# EAGLE design habitat (EAGLE 9.4.2)

## Sheet 1 of 2
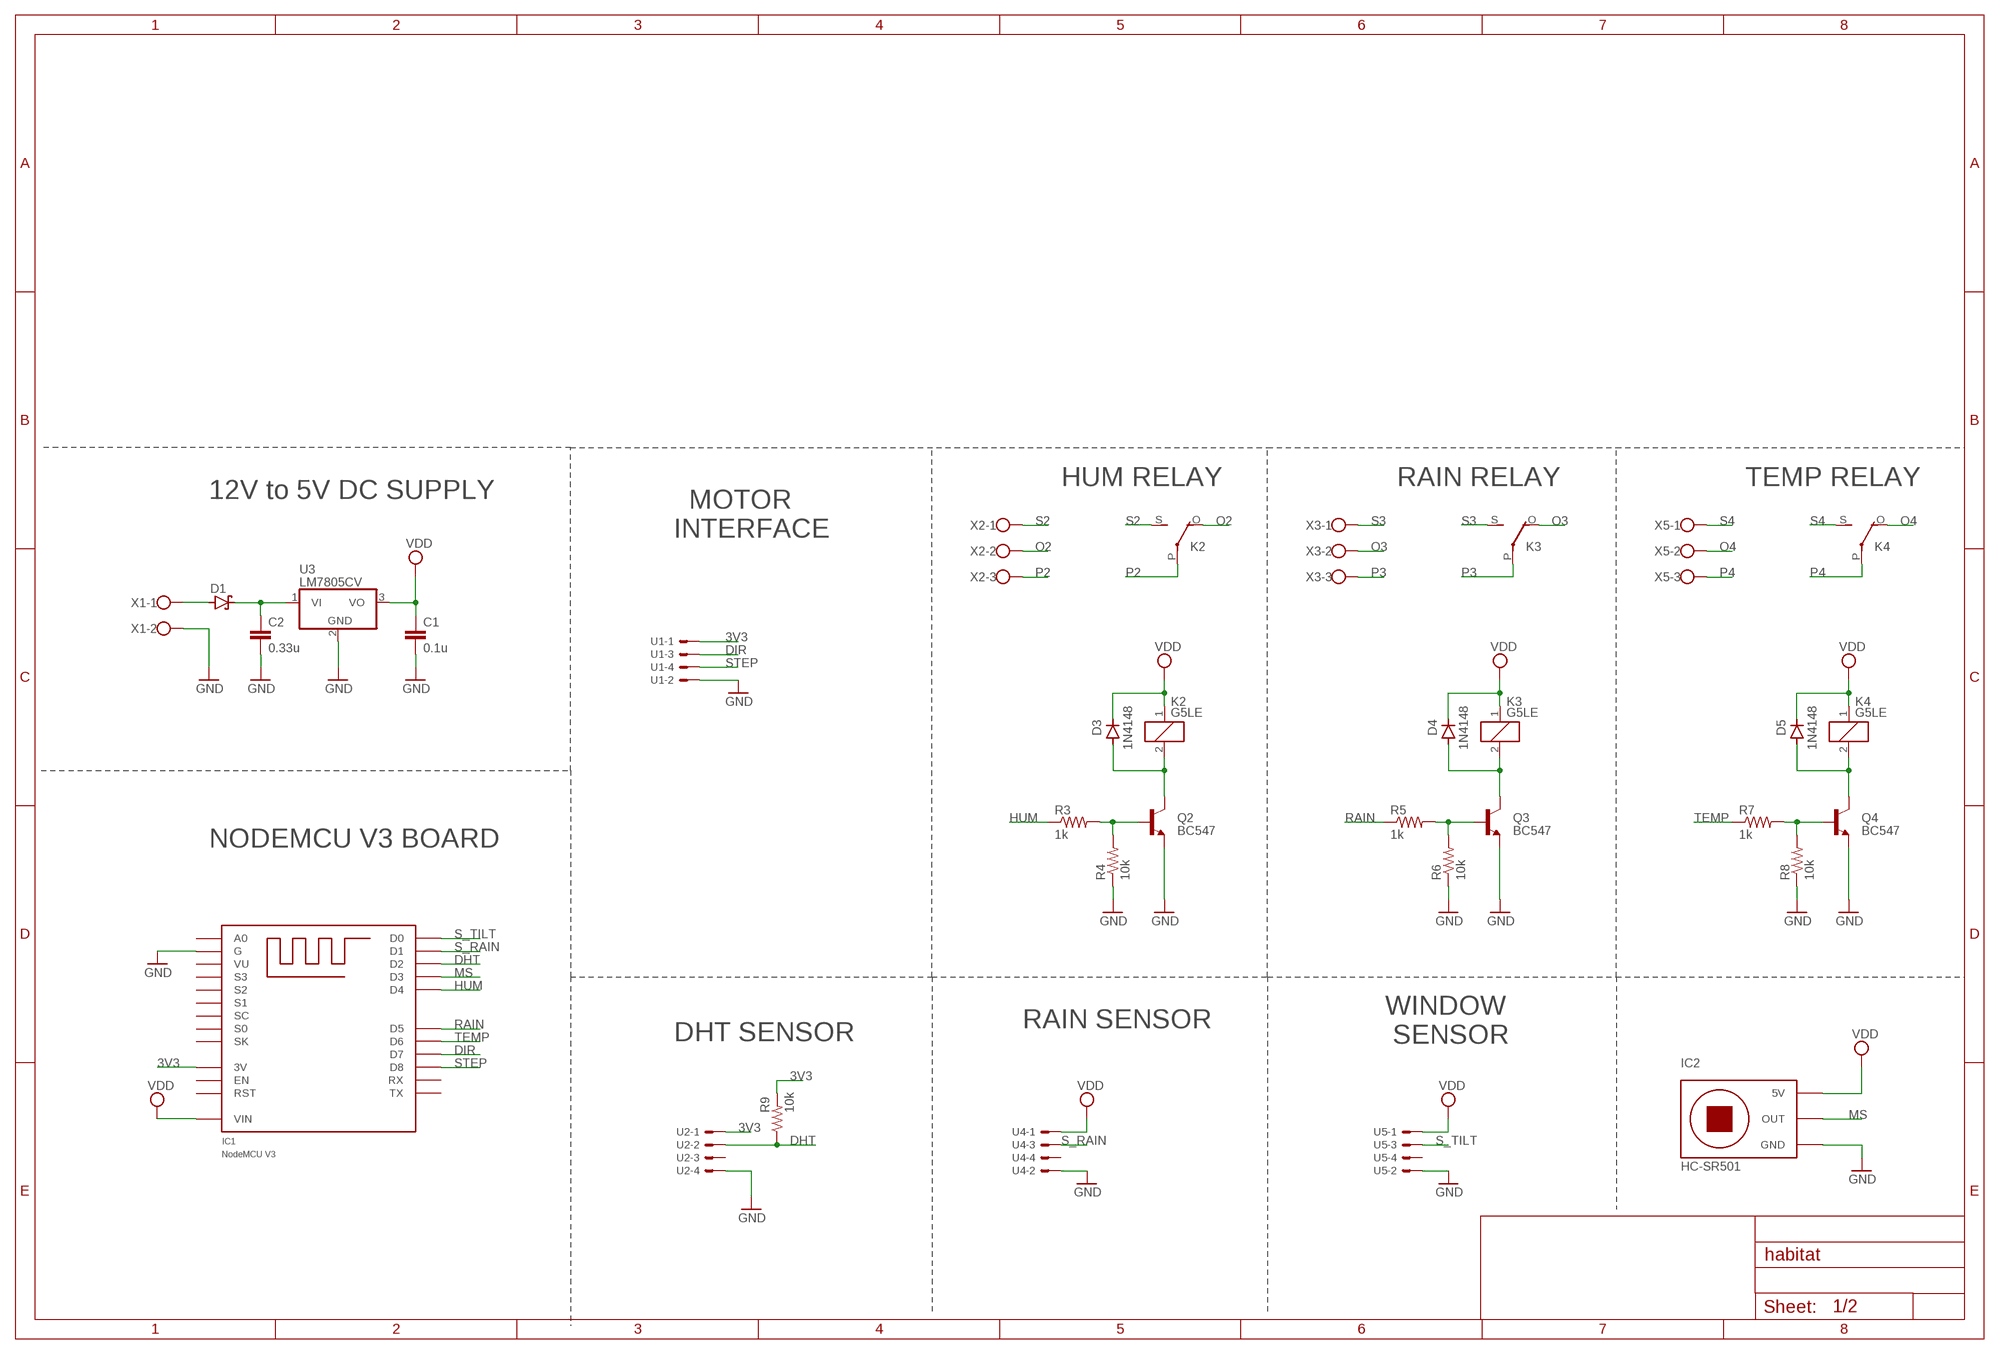
[diagram p0: schematic, sheet 1]

### Parts
C1  0.1u  C-EU025-030X050  [C025-030X050]
C2  0.33u  C-EU025-030X050  [C025-030X050]
D1  1N5817-T  [DO41-7.6]
D3  1N4148  1N4148DO35-7  [DO35-7]
D4  1N4148  1N4148DO35-7  [DO35-7]
D5  1N4148  1N4148DO35-7  [DO35-7]
IC1  NODEMCU_V3  [NODEMCU_V3]
IC2  HC-SR501  [HC-SR501]
K2  G5LE  [G5LE]
K3  G5LE  [G5LE]
K4  G5LE  [G5LE]
Q2  BC547  [TO92]
Q3  BC547  [TO92]
Q4  BC547  [TO92]
R3  1k  R-US_0309/10  [0309/10]
R4  10k  R-US_0309/10  [0309/10]
R5  1k  R-US_0309/10  [0309/10]
R6  10k  R-US_0309/10  [0309/10]
R7  1k  R-US_0309/10  [0309/10]
R8  10k  R-US_0309/10  [0309/10]
R9  10k  R-US_0309/10  [0309/10]
U1  KK-156-4  [KK-156-4]
U2  KK-156-4  [KK-156-4]
U3  LM7805CV  7805T  [TO220H]
U4  KK-156-4  [KK-156-4]
U5  KK-156-4  [KK-156-4]
X1  W237-102  [W237-102]
X2  W237-103  [W237-103]
X3  W237-103  [W237-103]
X5  W237-103  [W237-103]

### Nets
3V3: IC1.P$11(3V) IC1.P$16(3V) IC1.P$25(3V) R9.2 U1.1 U2.1
DHT: IC1.P$28(D2) R9.1 U2.2
DIR: IC1.P$21(D7) U1.3
GND: C1.2 C2.2 IC1.P$2(G) IC1.P$10(G) IC1.P$14(G) IC1.P$17(G) IC1.P$24(G) IC2.GND Q2.1(E) Q3.1(E) Q4.1(E) R4.1 R6.1 R8.1 U1.2 U2.4 U3.2(GND) U4.2 U5.2 X1.2
HUM: IC1.P$26(D4) R3.1
MS: IC1.P$27(D3) IC2.OUT
N$1: C2.1 D1.C U3.1(VI)
N$2: D1.A X1.1
N$3: D3.A K2.2 Q2.3(C)
N$4: Q2.2(B) R3.2 R4.2
N$5: D4.A K3.2 Q3.3(C)
N$6: Q3.2(B) R5.2 R6.2
N$7: D5.A K4.2 Q4.3(C)
N$8: Q4.2(B) R7.2 R8.2
O2: K2.O(2:O) X2.2
O3: K3.O(2:O) X3.2
O4: K4.O(2:O) X5.2
P2: K2.P(2:P) X2.3
P3: K3.P(2:P) X3.3
P4: K4.P(2:P) X5.3
RAIN: IC1.P$23(D5) R5.1
S2: K2.S(2:S) X2.1
S3: K3.S(2:S) X3.1
S4: K4.S(2:S) X5.1
S_RAIN: IC1.P$29(D1) U4.3
S_TILT: IC1.P$30(D0) U5.3
STEP: IC1.P$20(D8) U1.4
TEMP: IC1.P$22(D6) R7.1
VDD: C1.1 D3.C D4.C D5.C IC1.P$15(VIN) IC2.VDD(5V) K2.1 K3.1 K4.1 U3.3(VO) U4.1 U5.1
Unconnected: IC1.P$1(A0) IC1.P$3(VU) IC1.P$4(S3) IC1.P$5(S2) IC1.P$6(S1) IC1.P$7(SC) IC1.P$8(S0) IC1.P$9(SK) IC1.P$12(EN) IC1.P$13(RST) IC1.P$18(TX) IC1.P$19(RX) U2.3 U4.4 U5.4

### Notes on the sheet
- HUM RELAY | RAIN RELAY | TEMP RELAY
- 12V to 5V DC SUPPLY
- MOTOR
  INTERFACE
- NODEMCU V3 BOARD
- RAIN SENSOR
- DHT SENSOR
- WINDOW
   SENSOR

## Sheet 2 of 2

## Library data of the parts
C1 C2 = rcl:C-EU: CAPACITOR, European symbol; SPICEPREFIX: C
D1 = diode:1N581*: 1.0A SCHOTTKY BARRIER RECTIFIER Source: http://www.diodes.com/datasheets/ds23001.pdf
D3-D5 = diode:1N4148: DIODE high speed (Philips)
IC1 = emndbed_std:NODEMCU_V3
IC2 = licenta:HC-SR501
K2-K4 = relay:G5LE: RELAY 1 x switch, 10 A/120 V AC, 8 A/30 V DC, Omron; OC_FARNELL: unknown; OC_NEWARK: unknown
Q2-Q4 = transistor:BC547: NPN TRANSISTOR
R3-R9 = rcl:R-US_: RESISTOR, American symbol; SPICEPREFIX: R
U1 U2 U4 U5 = con-molex:KK-156-4: KK 156 HEADER Source: http://www.molex.com/pdm_docs/sd/026604100_sd.pdf; MF: MOLEX; OC_FARNELL: unknown; OC_NEWARK: unknown
U3 = linear:78*: Positive VOLTAGE REGULATOR Source: http://cache.national.com/ds/LM/LM78L05.pdf http://www.fairchildsemi.com/ds/LM/LM7805.pdf
X1 = con-wago-500:W237-102: WAGO SCREW CLAMP; MPN: 237-102; OC_FARNELL: unknown; OC_NEWARK: 70K9898
X2 X3 X5 = con-wago-500:W237-103: WAGO SCREW CLAMP; MPN: 237-103; OC_FARNELL: unknown; OC_NEWARK: 18M7116

## Board
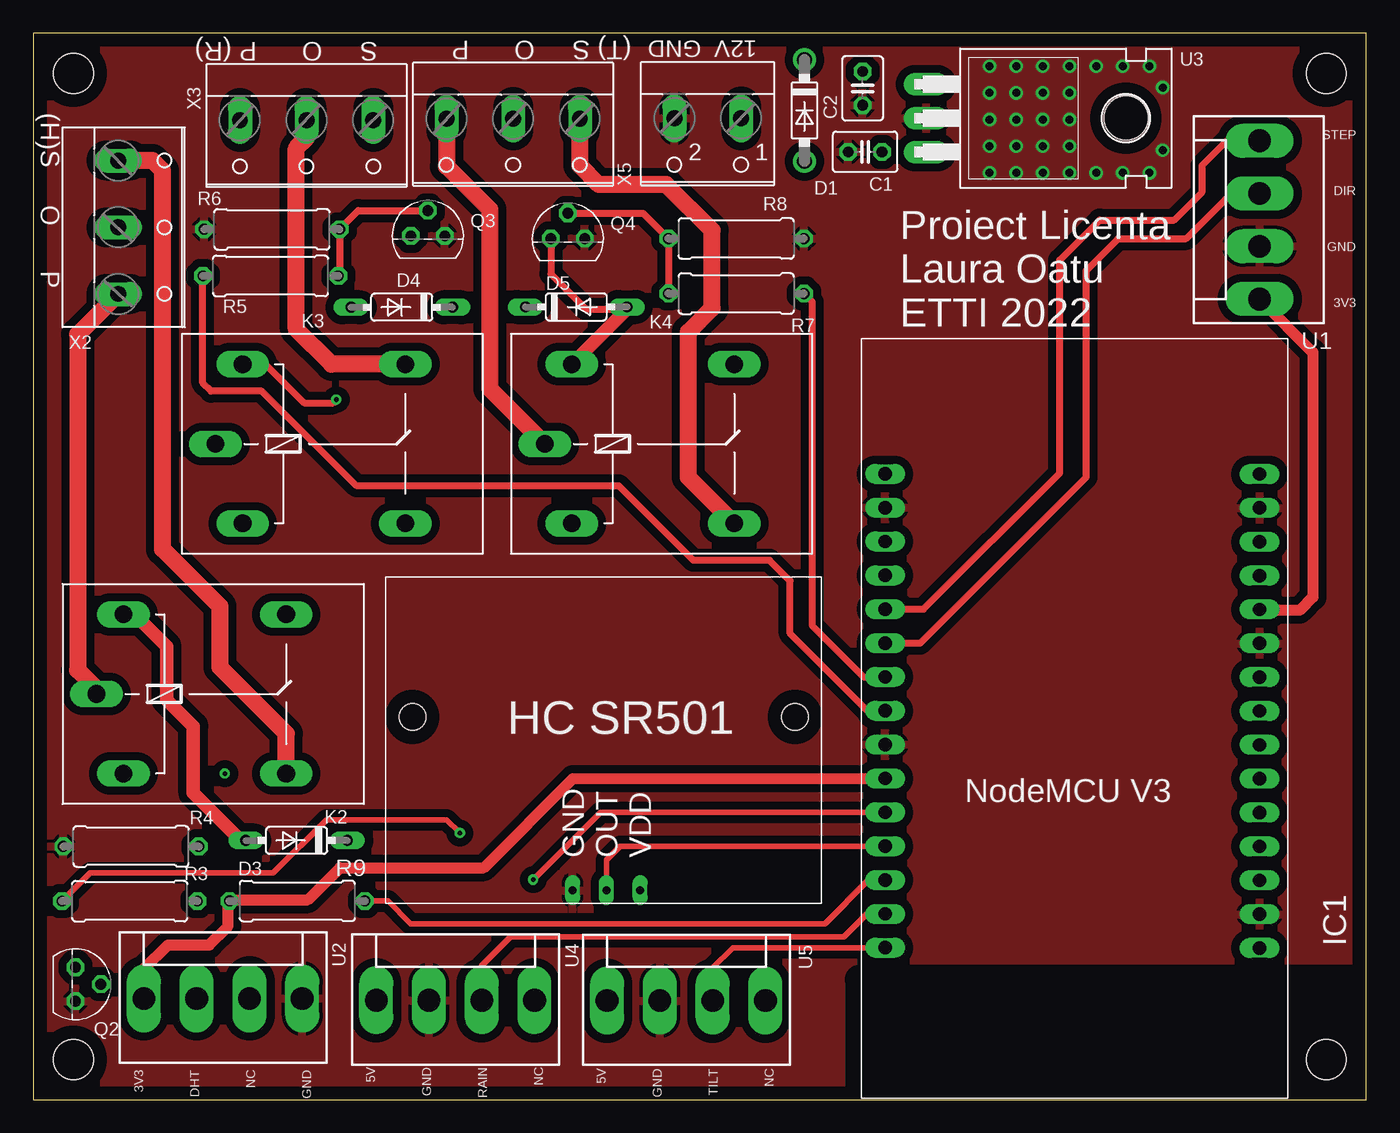
[diagram p1: board, top side]
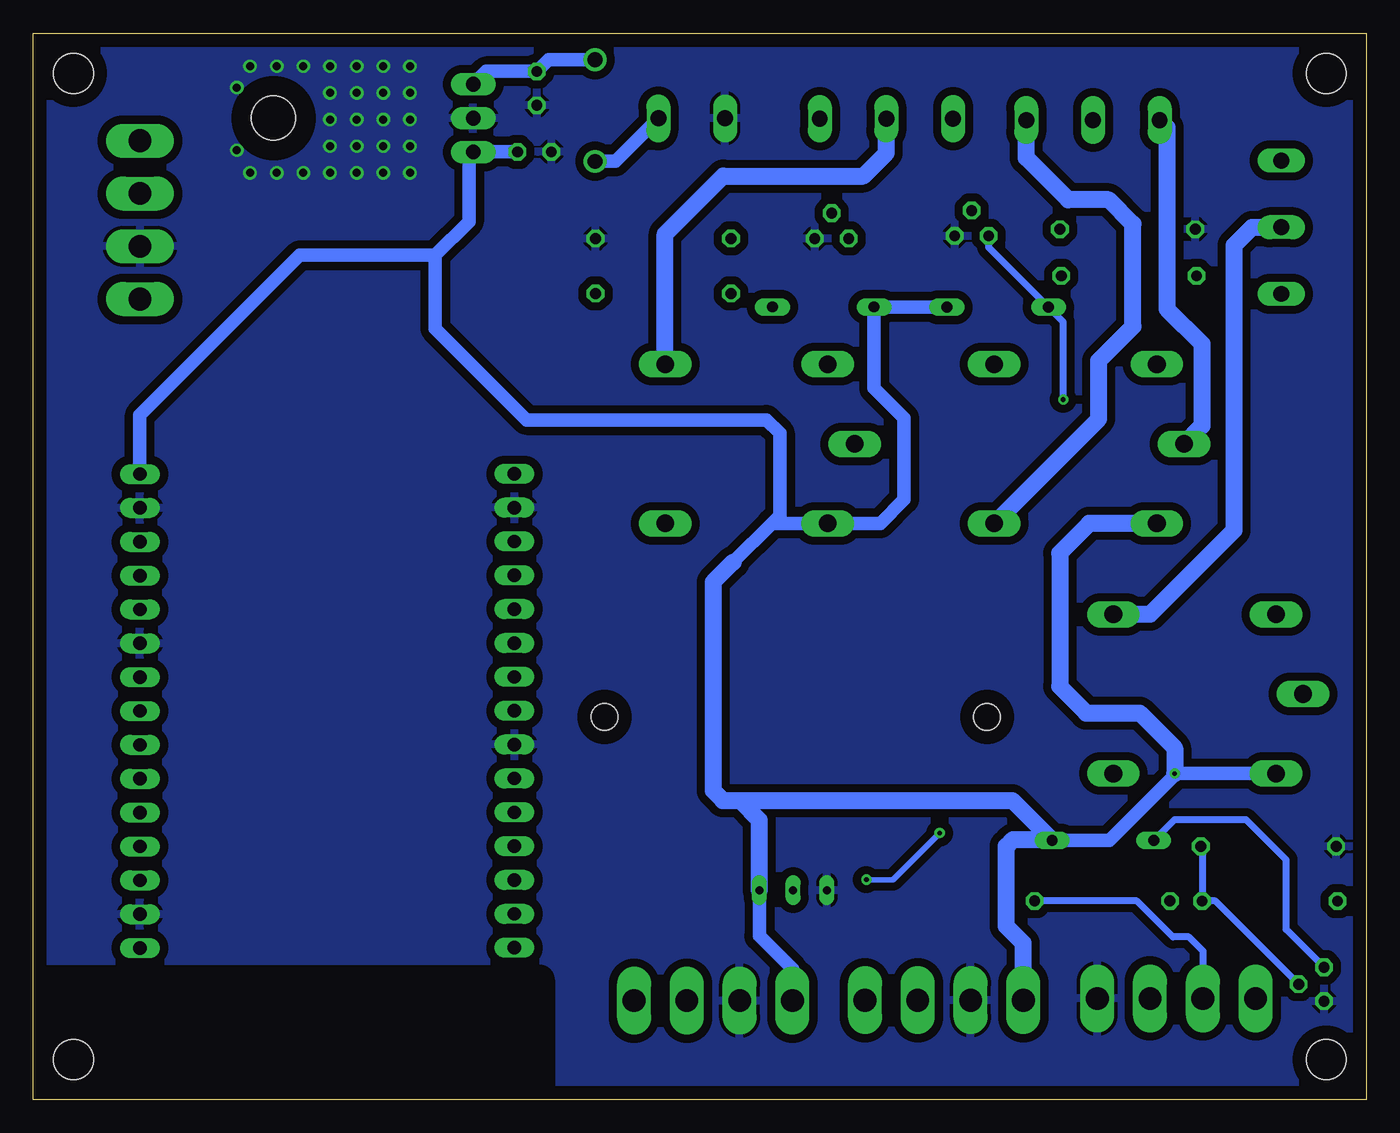
[diagram p2: board, bottom side, seen from below]

Size 100 x 80 mm. Coordinates in mm from the lower left corner, seen from the top.
Outline: 0,0 100,0 100,80 0,80 0,0
Copper layers (1*16): Top 0.035mm / dielectric 1.5mm / Bottom 0.035mm
Design rules "default": minimum track width 6mil, minimum drill 0.35mm, track to track 6mil, track to pad 6mil, pad to pad 6mil, via to via 6mil, smd to smd 6mil, copper to edge 40mil, drill to drill 6mil, minimum pad ring 10mil, minimum via ring 8mil, stop-mask expansion 4mil, vias tented up to drill 0mil, thermal gap 10mil
Holes 3 mm at 97,3 3,3 3,77 97,77
tRestrict: area 62,0 to 100,9
bRestrict: area 62,0 to 100,9

### Footprints (pad centres in the part's own frame; a part is rotated, then mirrored left to right if it is on the bottom)
C025-030X050 = drill 0.813 octagon: 1 -1.27,0; 2 1.27,0
DO41-7.6 = drill 1.1 pad 1.7: A 3.81,0; C -3.81,0
DO35-7 = drill 0.813 long: A 3.81,0; C -3.81,0
NODEMCU_V3 = drill 1 long: P$1 2.397,45.73; P$2 2.397,43.19; P$3 2.397,40.65; P$4 2.397,38.11; P$5 2.397,35.57; P$6 2.397,33.03; P$7 2.397,30.49; P$8 2.397,27.95; P$9 2.397,25.41; P$10 2.397,22.87; P$11 2.397,20.33; P$12 2.397,17.79; P$13 2.397,15.25; P$14 2.397,12.71; P$15 2.397,10.17; P$16 30.496,10.15; P$17 30.496,12.69; P$18 30.496,15.23; P$19 30.496,17.77; P$20 30.496,20.31; P$21 30.496,22.85; P$22 30.496,25.39; P$23 30.496,27.93; P$24 30.496,30.47; P$25 30.496,33.01; P$26 30.496,35.55; P$27 30.496,38.09; P$28 30.496,40.63; P$29 30.496,43.17; P$30 30.496,45.71
HC-SR501 = drill 0.6 long: GND 14.02,1; OUT 16.55,1; VDD 19.08,1 | hole 2: 2,14; 30.7,14
G5LE = drill 1.321 long: 1 -7.493,-5.969; 2 -7.493,5.969; O 4.699,5.969; P -9.525,0; S 4.699,-5.969
TO92 = drill 0.813 octagon: 1 1.27,0; 2 0,1.905; 3 -1.27,0
0309/10 = drill 0.813 octagon: 1 -5.08,0; 2 5.08,0
KK-156-4 = drill 1.7 pad 2.184 long: 1 -5.94,0; 2 -1.98,0; 3 1.98,0; 4 5.94,0
TO220H = drill 1.118 long: 1 -2.54,-10.16; 2 0,-10.16; 3 2.54,-10.16 | hole 3.302: 0,4.826
W237-102 = drill 1.194 long: 1 -2.5,-1.27; 2 2.5,-1.27
W237-103 = drill 1.194 long: 1 -5,-1.29; 2 0,-1.29; 3 5,-1.29

### Placement (x,y rotation side)
C1  62.41,71.11 180 top
C2  62.22,75.87 270 top
D1  57.85,74.2 270 top
D3  19.75,19.44 180 top
D4  27.65,59.45 180 top
D5  40.73,59.47 0 top
IC1  94.4,57.1 180 top
IC2  26.44,14.71 0 top
K2  14.27,30.43 0 top
K3  23.2,49.2 0 top
K4  47.9,49.2 0 top
Q2  3.16,8.65 270 top
Q3  29.6,64.8 0 top
Q4  40.1,64.6 0 top
R3  7.23,14.89 0 top
R4  7.33,18.99 0 top
R5  17.8,61.8 0 top
R6  17.9,65.3 0 top
R7  52.73,60.47 180 top
R8  52.73,64.6 180 top
R9  19.8,14.9 180 top
U1  92,66 90 top
U2  14.23,7.58 0 top
U3  77.15,73.64 270 top
U4  31.66,7.45 0 top
U5  48.99,7.42 0 top
X1  50.6,72.36 180 top
X2  7.66,65.45 270 top
X3  20.5,72.2 180 top
X5  36,72.3 180 top

### Tracks (layer width: path | path; a pad name or v marks a point on that pad's centre or on a via)
3V3
  Top 0.508: 14.6,14.78 R9.2
  Top 0.813: U2.1 8.29,9.79 10.1,11.6 13.2,11.6 14.6,13 14.6,14.78 | R9.2 14.82,15 20.6,15 23,17.4 33.8,17.4 40.49,24.09 IC1.P$25 | U1.1 96,56.06 96,37.7 95,36.7 92.07,36.7 IC1.P$11
DHT
  Top 0.406: R9.1 26.6,14.9 28.3,13.2 59.4,13.2 62.67,16.47 IC1.P$28
  Bottom 0.508: R9.1 17.2,14.9 14.5,12.2 13.3,12.2 12.25,11.15 U2.2
DIR
  Top 0.508: IC1.P$21 66.55,34.25 79,46.7 79,62.2 81.4,64.6 86.5,64.6 89.88,67.98 U1.3
GND  (via drill 0.6)
  other vias: 77.74,71.53 77.74,73.53 77.74,75.53 75.74,75.53 75.74,73.53 73.74,73.53 73.74,75.53 73.74,77.53 75.74,77.53 77.74,77.53 75.74,71.53 73.74,71.53 73.74,69.53 75.74,69.53 77.74,69.53 79.74,69.53 81.74,69.53 83.74,69.53 79.74,77.53 81.74,77.53 83.74,77.53 84.74,75.93 84.74,71.23 71.74,69.53 71.74,71.53 71.74,73.53 71.74,75.53 71.74,77.53
  pour Top (isolate 0.61): -2.54,81.99 -2.54,-2.54 102.71,-2.54 102.71,81.99
  pour Bottom (isolate 0.61): -2.54,80.99 -2.54,-0.27 101.44,-0.27 101.44,80.99
HUM  (via drill 0.35)
  Top 0.406: IC1.P$26 42.55,21.55 v37.5,16.5 | R3.1 4.26,17 18,17 22,21 31,21 v32,20
  Bottom 0.406: v32,20 35.5,16.5 v37.5,16.5
MS
  Top 0.406: IC2.OUT 43,18 44.01,19.01 IC1.P$27
N$1
  Bottom 1.016: D1.C 61.34,78.01 C2.1 66.03,77.14 U3.1
N$2
  Bottom 1.016: D1.A 56.33,70.39 X1.1
N$3
  Top 1.016: D3.A 15.56,19.44 12,23 12,28 10,30 10,34 7.6,36.4 K2.2
  Bottom 0.508: Q2.3 6,12.76 6,18 9,21 14.38,21 D3.A
N$4
  Bottom 0.508: R4.2 12.31,18.89 R3.2 11.3,14.89 Q2.2
N$5  (via drill 0.35)
  Top 0.508: K3.2 17.41,55.17 20.32,52.26 22.48,52.26 v22.73,52.51
  Bottom 0.508: v22.73,52.51 22.73,58.34 D4.A 28.33,63.94 Q3.3
N$6
  Top 0.508: R5.2 22.98,61.9 R6.2 24.39,66.7 Q3.2
N$7
  Top 0.508: Q4.3 38.83,61.94 41.47,59.31 44.45,59.31 | 44.45,59.31 44.55,59.31 | D5.A 44.55,59.4 44.45,59.31
  Top 1.016: K4.2 44.55,59.31
N$8
  Top 0.508: Q4.2 45.75,66.5 R8.2 R7.2
O2
  Bottom 1.27: K2.O 16.23,36.4 9.9,42.72 9.9,64.1 8.55,65.45 X2.2
O3
  Top 1.27: K3.O 22.36,55.17 19.73,57.81 19.73,71.37 20.5,72.14 X3.2
O4
  Bottom 1.27: K4.O 52.6,64.94 48.24,69.29 37.72,69.29 36,71.01 X5.2
P2
  Top 1.27: K2.P 4.75,30.8 3.33,32.22 3.33,57.41 X2.3
P3
  Bottom 1.27: X3.3 14.94,72.93 14.94,59.32 12.32,56.7 12.32,50.56 K3.P
P4
  Top 1.27: X5.3 31,70.03 34.24,66.79 34.24,53.34 K4.P
RAIN
  Top 0.508: R5.1 12.72,53.76 13.34,53.15 17.14,53.15 24.26,46.04 43.94,46.04 49.53,40.45 55.24,40.45 56.77,38.92 56.77,34.99 62.59,29.17 IC1.P$23
S2
  Top 1.27: K2.S 18.97,27.46 14,32.43 14,37 9.7,41.3 9.7,69.7 8.95,70.45 X2.1
S3
  Bottom 1.27: K3.S 20.07,51.06 20.07,55.43 17.5,58 17.5,65.7 19.32,67.52 22.35,67.52 25.5,70.66 X3.1
S4
  Top 1.27: K4.S 49.15,46.68 49.15,57.59 50.93,59.37 50.93,65.21 47.48,68.66 42.42,68.66 41,70.08 X5.1
S_RAIN
  Top 0.406: IC1.P$29 62.53,13.93 60.8,12.2 35.8,12.2 33.65,10.04 U4.3
S_TILT
  Top 0.406: U5.3 50.97,9.87 52.49,11.39 IC1.P$30
STEP
  Top 0.508: IC1.P$20 66.79,36.79 77,47 77,63 80,66 85.6,66 87.7,68.1 87.7,70.1 89.54,71.94 U1.4
TEMP
  Top 0.508: R7.1 58.42,59.87 58.42,35.58 62.29,31.71 IC1.P$22
VDD  (via drill 0.35)
  Bottom 0.508: 36.83,59.47 D5.C
  Bottom 1.016: C1.1 U3.3 67.31,70.78 67.31,65.88 69.85,63.34 | 69.85,63.34 80.01,63.34 92,51.35 IC1.P$15 | D4.C 31.48,59.47 36.83,59.47 | D5.C 36.92,53.37 34.67,51.12 34.67,45.02 36.46,43.23 K4.1 44.59,43.23 | v14.37,24.46 14.3,24.4 | K2.1 14.24,24.46 14.3,24.4 | D3.C 19.26,19.44 14.3,24.4 | 44.59,43.23 47.5,40.32 | U5.1 43.05,9.8 45.52,12.27 IC2.VDD | 69.85,63.34 69.85,57.85 63,51 45,51 44,50 44,43.82 44.59,43.23
  Bottom 1.27: K3.1 20.77,43.23 23,41 23,31 21,29 17,29 14.37,26.37 v14.37,24.46 | D3.C 23.63,19.51 | 23.63,19.51 26.56,22.44 47,22.44 | 47,22.44 48.26,22.44 49,23.18 49,38.82 47.5,40.32 | IC2.VDD 45.52,20.96 47,22.44 | U4.1 25.73,11.72 27,13 27,19 26.49,19.51 23.63,19.51

### Text on the board
tPlace: 12V GND | S O P (R) | (T) S O P | (H)S O P | STEP / / / / DIR / / / / GND / / / / 3V3 | Proiect Licenta / Laura Oatu / ETTI 2022 | 3V3 / / / / DHT / / / / NC / / / / GND | 5V / / / / GND / / / / RAIN / / / / NC | 5V / / / / GND / / / / TILT / / / / NC